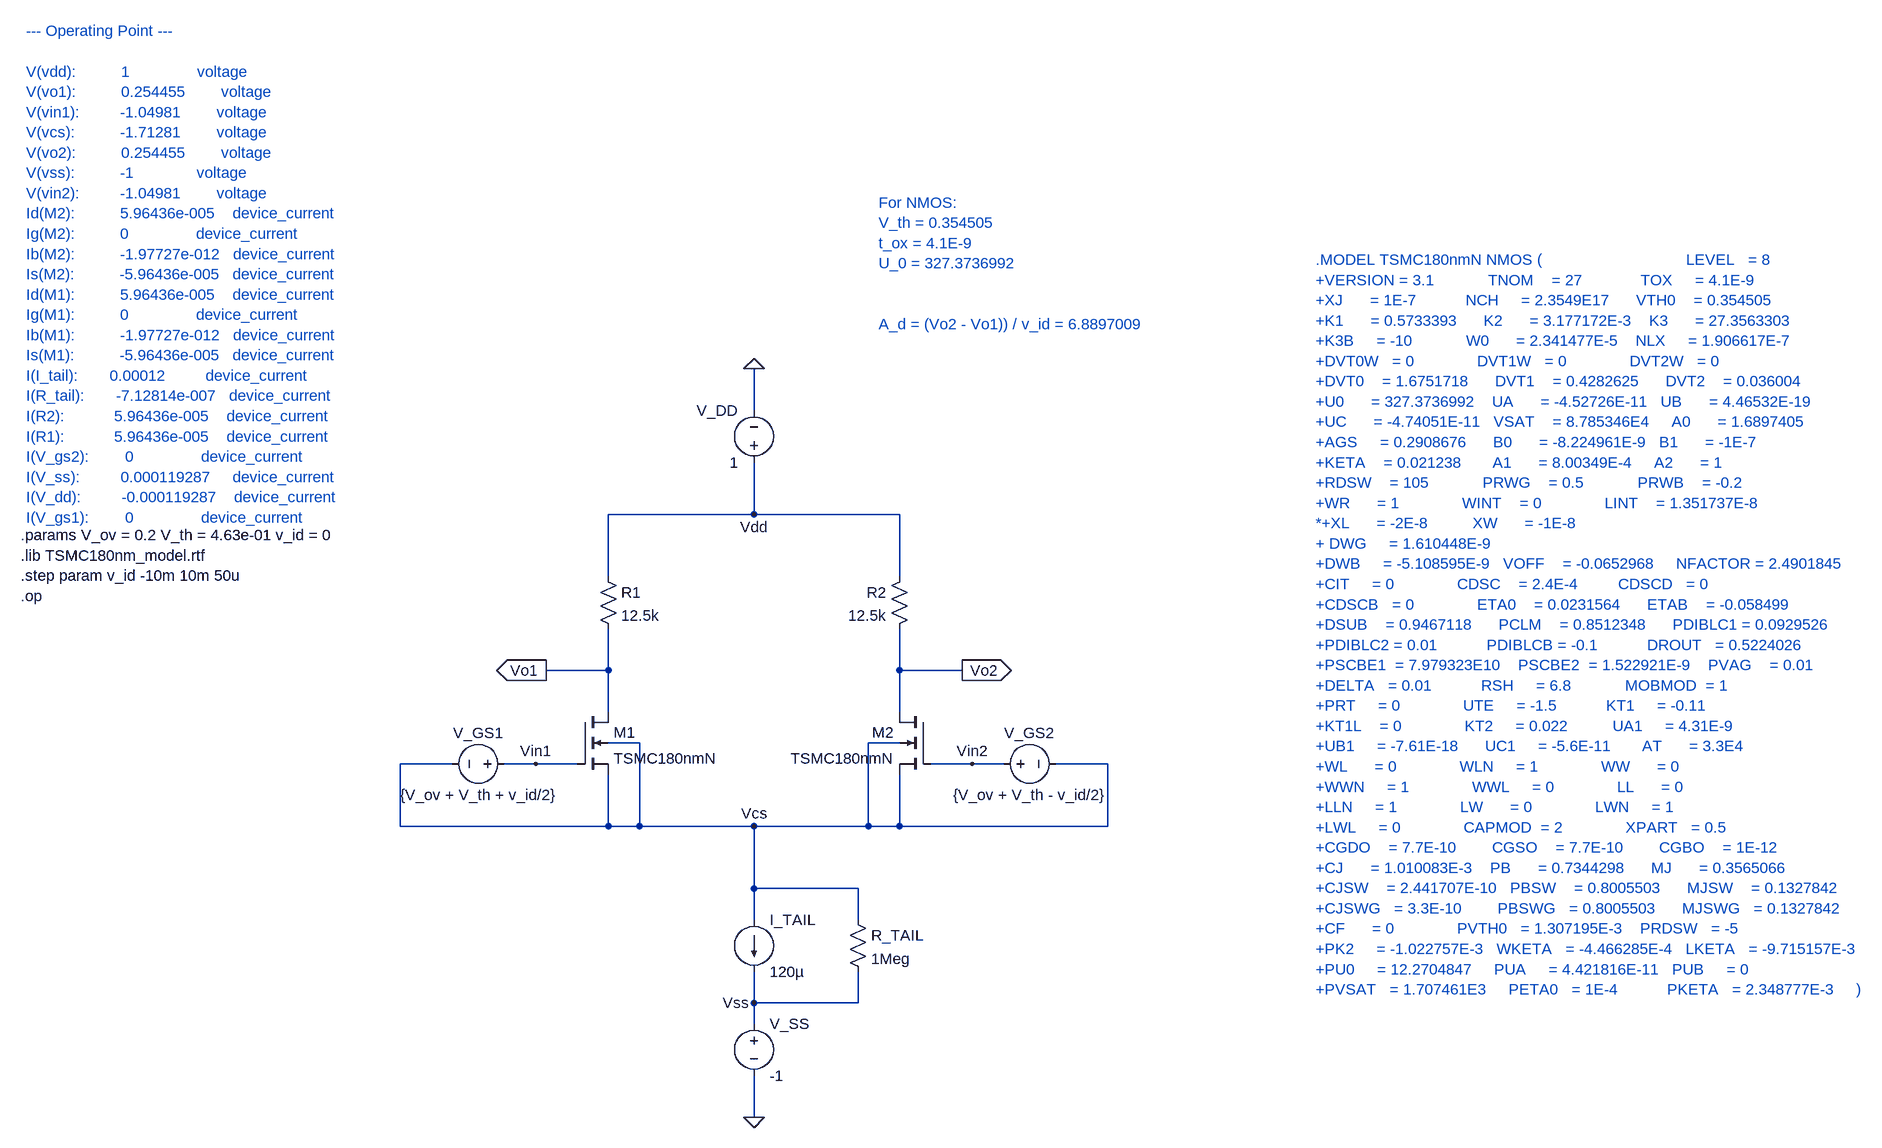
[diagram p0: schematic diff_amp.asc]
diff_amp.asc, the LTspice schematic file:
Version 4
SHEET 1 2128 884
WIRE 368 -224 368 -288
WIRE 368 -64 368 -144
WIRE 368 -64 144 -64
WIRE 592 -64 368 -64
WIRE 144 32 144 -64
WIRE 592 32 592 -64
WIRE 144 176 144 112
WIRE 144 176 48 176
WIRE 592 176 592 112
WIRE 688 176 592 176
WIRE 144 240 144 176
WIRE 592 240 592 176
WIRE 192 288 144 288
WIRE 592 288 544 288
WIRE -96 320 -176 320
WIRE 32 320 -16 320
WIRE 96 320 32 320
WIRE 704 320 640 320
WIRE 752 320 704 320
WIRE 912 320 832 320
WIRE -176 416 -176 320
WIRE 144 416 144 336
WIRE 144 416 -176 416
WIRE 192 416 192 288
WIRE 192 416 144 416
WIRE 368 416 192 416
WIRE 544 416 544 288
WIRE 544 416 368 416
WIRE 592 416 592 336
WIRE 592 416 544 416
WIRE 912 416 912 320
WIRE 912 416 592 416
WIRE 368 512 368 416
WIRE 528 512 368 512
WIRE 368 560 368 512
WIRE 528 560 528 512
WIRE 368 688 368 640
WIRE 528 688 528 640
WIRE 528 688 368 688
WIRE 368 720 368 688
WIRE 368 864 368 800
FLAG 368 -288 0
FLAG 368 864 0
FLAG 48 176 Vo1
IOPIN 48 176 Out
FLAG 688 176 Vo2
IOPIN 688 176 Out
FLAG 32 320 Vin1
FLAG 704 320 Vin2
FLAG 368 -64 Vdd
FLAG 368 688 Vss
FLAG 368 416 Vcs
SYMBOL res 128 16 R0
SYMATTR InstName R1
SYMATTR Value 12.5k
SYMBOL voltage 0 320 R90
WINDOW 0 -32 56 VBottom 2
WINDOW 3 32 56 VTop 2
SYMATTR InstName V_GS1
SYMATTR Value {V_ov + V_th + v_id/2}
SYMBOL res 608 16 M0
SYMATTR InstName R2
SYMATTR Value 12.5k
SYMBOL voltage 368 -128 R180
WINDOW 0 24 96 Left 2
WINDOW 3 24 16 Left 2
SYMATTR InstName V_DD
SYMATTR Value 1
SYMBOL current 368 560 R0
SYMATTR InstName I_TAIL
SYMATTR Value 120µ
SYMBOL voltage 368 704 R0
SYMATTR InstName V_SS
SYMATTR Value -1
SYMBOL res 512 544 R0
SYMATTR InstName R_TAIL
SYMATTR Value 1Meg
SYMBOL voltage 736 320 M90
WINDOW 0 -32 56 VBottom 2
WINDOW 3 32 56 VTop 2
SYMATTR InstName V_GS2
SYMATTR Value {V_ov + V_th - v_id/2}
SYMBOL nmos4 96 240 R0
SYMATTR InstName M1
SYMATTR Value TSMC180nmN
SYMATTR Value2 l=180n w=1.958508u
SYMBOL nmos4 640 240 M0
SYMATTR InstName M2
SYMATTR Value TSMC180nmN
SYMATTR Value2 l=180n w=1.958508u
TEXT -760 -32 Left 2 !.params V_ov = 0.2 V_th = 4.63e-01 v_id = 0\n.lib TSMC180nm_model.rtf\n.step param v_id -10m 10m 50u\n.op
TEXT 1232 -456 Left 2 ;.MODEL TSMC180nmN NMOS (                                LEVEL   = 8\n+VERSION = 3.1            TNOM    = 27             TOX     = 4.1E-9\n+XJ      = 1E-7           NCH     = 2.3549E17      VTH0    = 0.354505\n+K1      = 0.5733393      K2      = 3.177172E-3    K3      = 27.3563303\n+K3B     = -10            W0      = 2.341477E-5    NLX     = 1.906617E-7\n+DVT0W   = 0              DVT1W   = 0              DVT2W   = 0\n+DVT0    = 1.6751718      DVT1    = 0.4282625      DVT2    = 0.036004\n+U0      = 327.3736992    UA      = -4.52726E-11   UB      = 4.46532E-19\n+UC      = -4.74051E-11   VSAT    = 8.785346E4     A0      = 1.6897405\n+AGS     = 0.2908676      B0      = -8.224961E-9   B1      = -1E-7\n+KETA    = 0.021238       A1      = 8.00349E-4     A2      = 1\n+RDSW    = 105            PRWG    = 0.5            PRWB    = -0.2\n+WR      = 1              WINT    = 0              LINT    = 1.351737E-8\n*+XL      = -2E-8          XW      = -1E-8         \n+ DWG     = 1.610448E-9\n+DWB     = -5.108595E-9   VOFF    = -0.0652968     NFACTOR = 2.4901845\n+CIT     = 0              CDSC    = 2.4E-4         CDSCD   = 0\n+CDSCB   = 0              ETA0    = 0.0231564      ETAB    = -0.058499\n+DSUB    = 0.9467118      PCLM    = 0.8512348      PDIBLC1 = 0.0929526\n+PDIBLC2 = 0.01           PDIBLCB = -0.1           DROUT   = 0.5224026\n+PSCBE1  = 7.979323E10    PSCBE2  = 1.522921E-9    PVAG    = 0.01\n+DELTA   = 0.01           RSH     = 6.8            MOBMOD  = 1\n+PRT     = 0              UTE     = -1.5           KT1     = -0.11\n+KT1L    = 0              KT2     = 0.022          UA1     = 4.31E-9\n+UB1     = -7.61E-18      UC1     = -5.6E-11       AT      = 3.3E4\n+WL      = 0              WLN     = 1              WW      = 0\n+WWN     = 1              WWL     = 0              LL      = 0\n+LLN     = 1              LW      = 0              LWN     = 1\n+LWL     = 0              CAPMOD  = 2              XPART   = 0.5\n+CGDO    = 7.7E-10        CGSO    = 7.7E-10        CGBO    = 1E-12\n+CJ      = 1.010083E-3    PB      = 0.7344298      MJ      = 0.3565066\n+CJSW    = 2.441707E-10   PBSW    = 0.8005503      MJSW    = 0.1327842\n+CJSWG   = 3.3E-10        PBSWG   = 0.8005503      MJSWG   = 0.1327842\n+CF      = 0              PVTH0   = 1.307195E-3    PRDSW   = -5\n+PK2     = -1.022757E-3   WKETA   = -4.466285E-4   LKETA   = -9.715157E-3\n+PU0     = 12.2704847     PUA     = 4.421816E-11   PUB     = 0\n+PVSAT   = 1.707461E3     PETA0   = 1E-4           PKETA   = 2.348777E-3     )
TEXT 560 -544 Left 2 ;For NMOS:\nV_th = 0.354505\nt_ox = 4.1E-9\nU_0 = 327.3736992\n \n \nA_d = (Vo2 - Vo1)) / v_id = 6.8897009
TEXT -752 -808 Left 2 ;--- Operating Point ---\n \nV(vdd):          1               voltage\nV(vo1):          0.254455        voltage\nV(vin1):         -1.04981        voltage\nV(vcs):          -1.71281        voltage\nV(vo2):          0.254455        voltage\nV(vss):          -1              voltage\nV(vin2):         -1.04981        voltage\nId(M2):          5.96436e-005    device_current\nIg(M2):          0               device_current\nIb(M2):          -1.97727e-012   device_current\nIs(M2):          -5.96436e-005   device_current\nId(M1):          5.96436e-005    device_current\nIg(M1):          0               device_current\nIb(M1):          -1.97727e-012   device_current\nIs(M1):          -5.96436e-005   device_current\nI(I_tail):       0.00012         device_current\nI(R_tail):       -7.12814e-007   device_current\nI(R2):           5.96436e-005    device_current\nI(R1):           5.96436e-005    device_current\nI(V_gs2):        0               device_current\nI(V_ss):         0.000119287     device_current\nI(V_dd):         -0.000119287    device_current\nI(V_gs1):        0               device_current

The netlist it stands for:
* diff_amp.asc
R1 Vdd Vo1 12.5k
V_GS1 Vin1 Vcs {V_ov + V_th + v_id/2}
R2 Vdd Vo2 12.5k
V_DD Vdd 0 1
I_TAIL Vcs Vss 120µ
V_SS Vss 0 -1
R_TAIL Vcs Vss 1Meg
V_GS2 Vin2 Vcs {V_ov + V_th - v_id/2}
M1 Vo1 Vin1 Vcs Vcs TSMC180nmN l=180n w=1.958508u
M2 Vo2 Vin2 Vcs Vcs TSMC180nmN l=180n w=1.958508u
.model NMOS NMOS
.model PMOS PMOS
.lib standard.mos
.params V_ov = 0.2 V_th = 4.63e-01 v_id = 0
.lib TSMC180nm_model.rtf
.step param v_id -10m 10m 50u
.op
* .MODEL TSMC180nmN NMOS (                                LEVEL   = 8
* +VERSION = 3.1            TNOM    = 27             TOX     = 4.1E-9
* +XJ      = 1E-7           NCH     = 2.3549E17      VTH0    = 0.354505
* +K1      = 0.5733393      K2      = 3.177172E-3    K3      = 27.3563303
* +K3B     = -10            W0      = 2.341477E-5    NLX     = 1.906617E-7
* +DVT0W   = 0              DVT1W   = 0              DVT2W   = 0
* +DVT0    = 1.6751718      DVT1    = 0.4282625      DVT2    = 0.036004
* +U0      = 327.3736992    UA      = -4.52726E-11   UB      = 4.46532E-19
* +UC      = -4.74051E-11   VSAT    = 8.785346E4     A0      = 1.6897405
* +AGS     = 0.2908676      B0      = -8.224961E-9   B1      = -1E-7
* +KETA    = 0.021238       A1      = 8.00349E-4     A2      = 1
* +RDSW    = 105            PRWG    = 0.5            PRWB    = -0.2
* +WR      = 1              WINT    = 0              LINT    = 1.351737E-8
* *+XL      = -2E-8          XW      = -1E-8
* + DWG     = 1.610448E-9
* +DWB     = -5.108595E-9   VOFF    = -0.0652968     NFACTOR = 2.4901845
* +CIT     = 0              CDSC    = 2.4E-4         CDSCD   = 0
* +CDSCB   = 0              ETA0    = 0.0231564      ETAB    = -0.058499
* +DSUB    = 0.9467118      PCLM    = 0.8512348      PDIBLC1 = 0.0929526
* +PDIBLC2 = 0.01           PDIBLCB = -0.1           DROUT   = 0.5224026
* +PSCBE1  = 7.979323E10    PSCBE2  = 1.522921E-9    PVAG    = 0.01
* +DELTA   = 0.01           RSH     = 6.8            MOBMOD  = 1
* +PRT     = 0              UTE     = -1.5           KT1     = -0.11
* +KT1L    = 0              KT2     = 0.022          UA1     = 4.31E-9
* +UB1     = -7.61E-18      UC1     = -5.6E-11       AT      = 3.3E4
* +WL      = 0              WLN     = 1              WW      = 0
* +WWN     = 1              WWL     = 0              LL      = 0
* +LLN     = 1              LW      = 0              LWN     = 1
* +LWL     = 0              CAPMOD  = 2              XPART   = 0.5
* +CGDO    = 7.7E-10        CGSO    = 7.7E-10        CGBO    = 1E-12
* +CJ      = 1.010083E-3    PB      = 0.7344298      MJ      = 0.3565066
* +CJSW    = 2.441707E-10   PBSW    = 0.8005503      MJSW    = 0.1327842
* +CJSWG   = 3.3E-10        PBSWG   = 0.8005503      MJSWG   = 0.1327842
* +CF      = 0              PVTH0   = 1.307195E-3    PRDSW   = -5
* +PK2     = -1.022757E-3   WKETA   = -4.466285E-4   LKETA   = -9.715157E-3
* +PU0     = 12.2704847     PUA     = 4.421816E-11   PUB     = 0
* +PVSAT   = 1.707461E3     PETA0   = 1E-4           PKETA   = 2.348777E-3     )
* For NMOS:
* V_th = 0.354505
* t_ox = 4.1E-9
* U_0 = 327.3736992
* A_d = (Vo2 - Vo1)) / v_id = 6.8897009
* --- Operating Point ---
* V(vdd):          1               voltage
* V(vo1):          0.254455        voltage
* V(vin1):         -1.04981        voltage
* V(vcs):          -1.71281        voltage
* V(vo2):          0.254455        voltage
* V(vss):          -1              voltage
* V(vin2):         -1.04981        voltage
* Id(M2):          5.96436e-005    device_current
* Ig(M2):          0               device_current
* Ib(M2):          -1.97727e-012   device_current
* Is(M2):          -5.96436e-005   device_current
* Id(M1):          5.96436e-005    device_current
* Ig(M1):          0               device_current
* Ib(M1):          -1.97727e-012   device_current
* Is(M1):          -5.96436e-005   device_current
* I(I_tail):       0.00012         device_current
* I(R_tail):       -7.12814e-007   device_current
* I(R2):           5.96436e-005    device_current
* I(R1):           5.96436e-005    device_current
* I(V_gs2):        0               device_current
* I(V_ss):         0.000119287     device_current
* I(V_dd):         -0.000119287    device_current
* I(V_gs1):        0               device_current
.backanno
.end